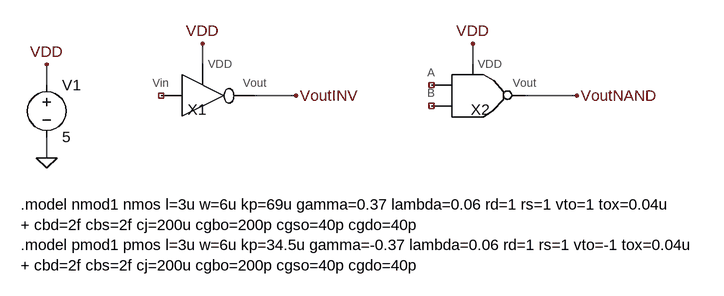
[diagram p0: schematic Test.asc]
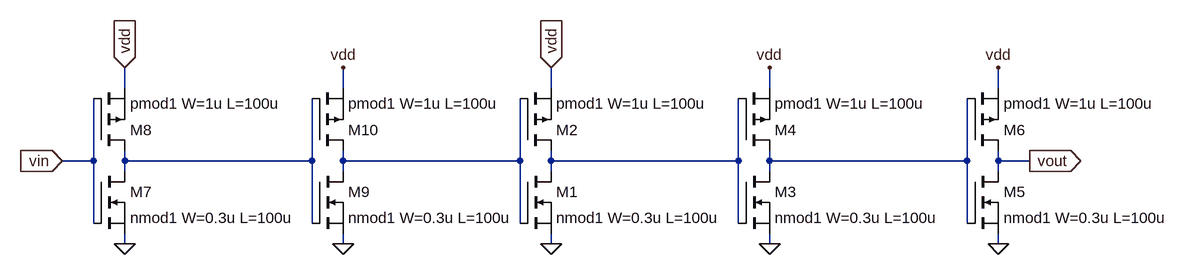
[diagram p1: sub-circuit inv.asc]
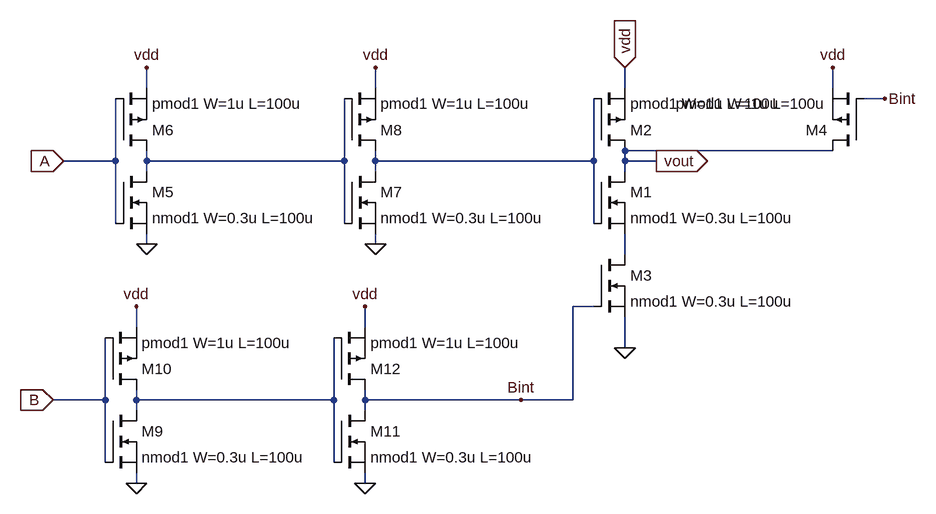
[diagram p2: sub-circuit nand.asc]
Test.asc, the LTspice schematic file:
Version 4
SHEET 1 1116 680
WIRE 224 -176 224 -208
WIRE 640 -176 640 -208
WIRE -16 -144 -16 -176
WIRE 368 -128 304 -128
WIRE 800 -128 720 -128
WIRE -16 -32 -16 -64
FLAG -16 -32 0
FLAG -16 -176 VDD
FLAG 224 -208 VDD
FLAG 640 -208 VDD
FLAG 368 -128 VoutINV
FLAG 800 -128 VoutNAND
SYMBOL INV 208 -128 R0
SYMATTR InstName X1
SYMBOL NAND 640 -128 R0
SYMATTR InstName X2
SYMBOL voltage -16 -160 R0
SYMATTR InstName V1
SYMATTR Value 5
TEXT -56 40 Left 2 !.model nmod1 nmos l=3u w=6u kp=69u gamma=0.37 lambda=0.06 rd=1 rs=1 vto=1 tox=0.04u\n+ cbd=2f cbs=2f cj=200u cgbo=200p cgso=40p cgdo=40p\n.model pmod1 pmos l=3u w=6u kp=34.5u gamma=-0.37 lambda=0.06 rd=1 rs=1 vto=-1 tox=0.04u\n+ cbd=2f cbs=2f cj=200u cgbo=200p cgso=40p cgdo=40p

inv.asc, the sub-circuit schematic file:
Version 4
SHEET 1 1116 680
WIRE -704 -288 -704 -320
WIRE -368 -288 -368 -320
WIRE -48 -288 -48 -320
WIRE 288 -288 288 -320
WIRE 640 -288 640 -320
WIRE -752 -176 -752 -272
WIRE -752 -176 -800 -176
WIRE -704 -176 -704 -192
WIRE -416 -176 -416 -272
WIRE -416 -176 -704 -176
WIRE -368 -176 -368 -192
WIRE -96 -176 -96 -272
WIRE -96 -176 -368 -176
WIRE -48 -176 -48 -192
WIRE 240 -176 240 -272
WIRE 240 -176 -48 -176
WIRE 288 -176 288 -192
WIRE 592 -176 592 -272
WIRE 592 -176 288 -176
WIRE 640 -176 640 -192
WIRE 688 -176 640 -176
WIRE -704 -160 -704 -176
WIRE -368 -160 -368 -176
WIRE -48 -160 -48 -176
WIRE 288 -160 288 -176
WIRE 640 -160 640 -176
WIRE -752 -80 -752 -176
WIRE -416 -80 -416 -176
WIRE -96 -80 -96 -176
WIRE 240 -80 240 -176
WIRE 592 -80 592 -176
WIRE -704 -48 -704 -64
WIRE -368 -48 -368 -64
WIRE -48 -48 -48 -64
WIRE 288 -48 288 -64
WIRE 640 -48 640 -64
FLAG -48 -48 0
FLAG -48 -320 vdd
IOPIN -48 -320 In
FLAG -800 -176 vin
IOPIN -800 -176 In
FLAG 688 -176 vout
IOPIN 688 -176 Out
FLAG 288 -48 0
FLAG 288 -320 vdd
FLAG 640 -48 0
FLAG 640 -320 vdd
FLAG -704 -48 0
FLAG -704 -320 vdd
IOPIN -704 -320 In
FLAG -368 -48 0
FLAG -368 -320 vdd
SYMBOL nmos -96 -160 R0
SYMATTR InstName M1
SYMATTR Value nmod1 W=0.3u L=100u
SYMBOL pmos -96 -192 M180
SYMATTR InstName M2
SYMATTR Value pmod1 W=1u L=100u
SYMBOL nmos 240 -160 R0
SYMATTR InstName M3
SYMATTR Value nmod1 W=0.3u L=100u
SYMBOL pmos 240 -192 M180
SYMATTR InstName M4
SYMATTR Value pmod1 W=1u L=100u
SYMBOL nmos 592 -160 R0
SYMATTR InstName M5
SYMATTR Value nmod1 W=0.3u L=100u
SYMBOL pmos 592 -192 M180
SYMATTR InstName M6
SYMATTR Value pmod1 W=1u L=100u
SYMBOL nmos -752 -160 R0
SYMATTR InstName M7
SYMATTR Value nmod1 W=0.3u L=100u
SYMBOL pmos -752 -192 M180
SYMATTR InstName M8
SYMATTR Value pmod1 W=1u L=100u
SYMBOL nmos -416 -160 R0
SYMATTR InstName M9
SYMATTR Value nmod1 W=0.3u L=100u
SYMBOL pmos -416 -192 M180
SYMATTR InstName M10
SYMATTR Value pmod1 W=1u L=100u

nand.asc, the sub-circuit schematic file:
Version 4
SHEET 1 1116 680
WIRE -688 -416 -688 -448
WIRE -336 -416 -336 -448
WIRE 48 -416 48 -448
WIRE 368 -416 368 -448
WIRE 448 -400 416 -400
WIRE 368 -320 48 -320
WIRE -736 -304 -736 -400
WIRE -736 -304 -816 -304
WIRE -688 -304 -688 -320
WIRE -384 -304 -384 -400
WIRE -384 -304 -688 -304
WIRE -336 -304 -336 -320
WIRE 0 -304 0 -400
WIRE 0 -304 -336 -304
WIRE 48 -304 48 -320
WIRE 96 -304 48 -304
WIRE -688 -288 -688 -304
WIRE -336 -288 -336 -304
WIRE 48 -288 48 -304
WIRE -736 -208 -736 -304
WIRE -384 -208 -384 -304
WIRE 0 -208 0 -304
WIRE -688 -176 -688 -192
WIRE -336 -176 -336 -192
WIRE 48 -160 48 -192
WIRE 0 -80 -32 -80
WIRE -704 -48 -704 -80
WIRE -352 -48 -352 -80
WIRE 48 -16 48 -64
WIRE -752 64 -752 -32
WIRE -752 64 -832 64
WIRE -704 64 -704 48
WIRE -400 64 -400 -32
WIRE -400 64 -704 64
WIRE -352 64 -352 48
WIRE -112 64 -352 64
WIRE -32 64 -32 -80
WIRE -32 64 -112 64
WIRE -704 80 -704 64
WIRE -352 80 -352 64
WIRE -752 160 -752 64
WIRE -400 160 -400 64
WIRE -704 192 -704 176
WIRE -352 192 -352 176
FLAG 48 -16 0
FLAG 48 -448 vdd
IOPIN 48 -448 In
FLAG -816 -304 A
IOPIN -816 -304 In
FLAG 96 -304 vout
IOPIN 96 -304 Out
FLAG -832 64 B
IOPIN -832 64 In
FLAG 368 -448 vdd
FLAG -688 -176 0
FLAG -688 -448 vdd
FLAG -336 -176 0
FLAG -336 -448 vdd
FLAG -704 192 0
FLAG -704 -80 vdd
FLAG -352 192 0
FLAG -352 -80 vdd
FLAG -112 64 Bint
FLAG 448 -400 Bint
SYMBOL nmos 0 -288 R0
SYMATTR InstName M1
SYMATTR Value nmod1 W=0.3u L=100u
SYMBOL pmos 0 -320 M180
SYMATTR InstName M2
SYMATTR Value pmod1 W=1u L=100u
SYMBOL nmos 0 -160 R0
SYMATTR InstName M3
SYMATTR Value nmod1 W=0.3u L=100u
SYMBOL pmos 416 -320 R180
SYMATTR InstName M4
SYMATTR Value pmod1 W=1u L=100u
SYMBOL nmos -736 -288 R0
SYMATTR InstName M5
SYMATTR Value nmod1 W=0.3u L=100u
SYMBOL pmos -736 -320 M180
SYMATTR InstName M6
SYMATTR Value pmod1 W=1u L=100u
SYMBOL nmos -384 -288 R0
SYMATTR InstName M7
SYMATTR Value nmod1 W=0.3u L=100u
SYMBOL pmos -384 -320 M180
SYMATTR InstName M8
SYMATTR Value pmod1 W=1u L=100u
SYMBOL nmos -752 80 R0
SYMATTR InstName M9
SYMATTR Value nmod1 W=0.3u L=100u
SYMBOL pmos -752 48 M180
SYMATTR InstName M10
SYMATTR Value pmod1 W=1u L=100u
SYMBOL nmos -400 80 R0
SYMATTR InstName M11
SYMATTR Value nmod1 W=0.3u L=100u
SYMBOL pmos -400 48 M180
SYMATTR InstName M12
SYMATTR Value pmod1 W=1u L=100u

The netlist it stands for:
* Test.asc
XX1 NC_01 VoutINV VDD inv
XX2 VDD VoutNAND NC_02 NC_03 nand
V1 VDD 0 5

* block symbol definitions
.subckt inv Vin Vout VDD
M1 N003 N002 0 0 nmod1 W=0.3u L=100u
M2 N003 N002 vdd vdd pmod1 W=1u L=100u
M3 N004 N003 0 0 nmod1 W=0.3u L=100u
M4 N004 N003 vdd vdd pmod1 W=1u L=100u
M5 vout N004 0 0 nmod1 W=0.3u L=100u
M6 vout N004 vdd vdd pmod1 W=1u L=100u
M7 N001 vin 0 0 nmod1 W=0.3u L=100u
M8 N001 vin vdd vdd pmod1 W=1u L=100u
M9 N002 N001 0 0 nmod1 W=0.3u L=100u
M10 N002 N001 vdd vdd pmod1 W=1u L=100u
.ends inv

.subckt nand VDD Vout A B
M1 vout N002 N003 N003 nmod1 W=0.3u L=100u
M2 vout N002 vdd vdd pmod1 W=1u L=100u
M3 N003 Bint 0 0 nmod1 W=0.3u L=100u
M4 vout Bint vdd vdd pmod1 W=1u L=100u
M5 N001 A 0 0 nmod1 W=0.3u L=100u
M6 N001 A vdd vdd pmod1 W=1u L=100u
M7 N002 N001 0 0 nmod1 W=0.3u L=100u
M8 N002 N001 vdd vdd pmod1 W=1u L=100u
M9 N004 B 0 0 nmod1 W=0.3u L=100u
M10 N004 B vdd vdd pmod1 W=1u L=100u
M11 Bint N004 0 0 nmod1 W=0.3u L=100u
M12 Bint N004 vdd vdd pmod1 W=1u L=100u
.ends nand

.model NMOS NMOS
.model PMOS PMOS
.lib standard.mos
.model nmod1 nmos l=3u w=6u kp=69u gamma=0.37 lambda=0.06 rd=1 rs=1 vto=1 tox=0.04u
+ cbd=2f cbs=2f cj=200u cgbo=200p cgso=40p cgdo=40p
.model pmod1 pmos l=3u w=6u kp=34.5u gamma=-0.37 lambda=0.06 rd=1 rs=1 vto=-1 tox=0.04u
+ cbd=2f cbs=2f cj=200u cgbo=200p cgso=40p cgdo=40p
.backanno
.end